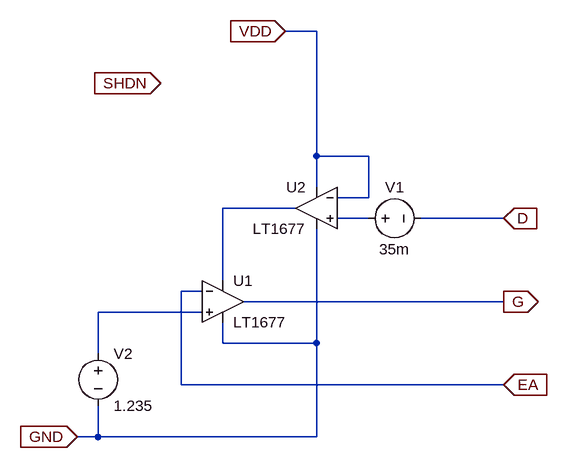
[diagram p0: schematic Stage_3_MIC5156.asc]
Stage_3_MIC5156.asc, the LTspice schematic file:
Version 4
SHEET 1 880 680
WIRE 256 -176 208 -176
WIRE 256 16 256 -176
WIRE 336 16 256 16
WIRE 256 64 256 16
WIRE 336 80 336 16
WIRE 336 80 288 80
WIRE 224 96 112 96
WIRE 336 112 288 112
WIRE 544 112 416 112
WIRE 112 208 112 96
WIRE 80 224 48 224
WIRE 544 240 144 240
WIRE 80 256 -80 256
WIRE 112 304 112 272
WIRE 256 304 256 128
WIRE 256 304 112 304
WIRE -80 320 -80 256
WIRE 48 368 48 224
WIRE 544 368 48 368
WIRE -80 448 -80 400
WIRE -80 448 -112 448
WIRE 256 448 256 304
WIRE 256 448 -80 448
FLAG -112 448 GND
IOPIN -112 448 In
FLAG 208 -176 VDD
IOPIN 208 -176 In
FLAG 544 112 D
IOPIN 544 112 In
FLAG 544 368 EA
IOPIN 544 368 In
FLAG 544 240 G
IOPIN 544 240 Out
FLAG 16 -96 SHDN
IOPIN 16 -96 In
SYMBOL voltage 320 112 R270
WINDOW 0 32 56 VTop 2
WINDOW 3 -32 56 VBottom 2
WINDOW 123 0 0 Left 0
WINDOW 39 0 0 Left 0
SYMATTR InstName V1
SYMATTR Value 35m
SYMBOL OpAmps\\LT1677 112 176 R0
SYMATTR InstName U1
SYMBOL OpAmps\\LT1677 256 32 M0
SYMATTR InstName U2
SYMBOL voltage -80 304 R0
WINDOW 123 0 0 Left 0
WINDOW 39 0 0 Left 0
SYMATTR InstName V2
SYMATTR Value 1.235

The netlist it stands for:
* Stage_3_MIC5156.asc
V1 N002 D 35m
XU1 N003 EA N001 GND G LT1677  ; pins In+ In- V+ V- OUT
XU2 N002 VDD VDD GND N001 LT1677  ; pins In+ In- V+ V- OUT
V2 N003 GND 1.235
.lib LTC.lib
.backanno
.end